# EasyEDA schematic Schematic.json
TITLE: Catch the Light; REV: 1.0; Date: 2024-08-20; Sheet: 1/1; Drawn By: Denis Majrich; Company: The Automation Warehouse
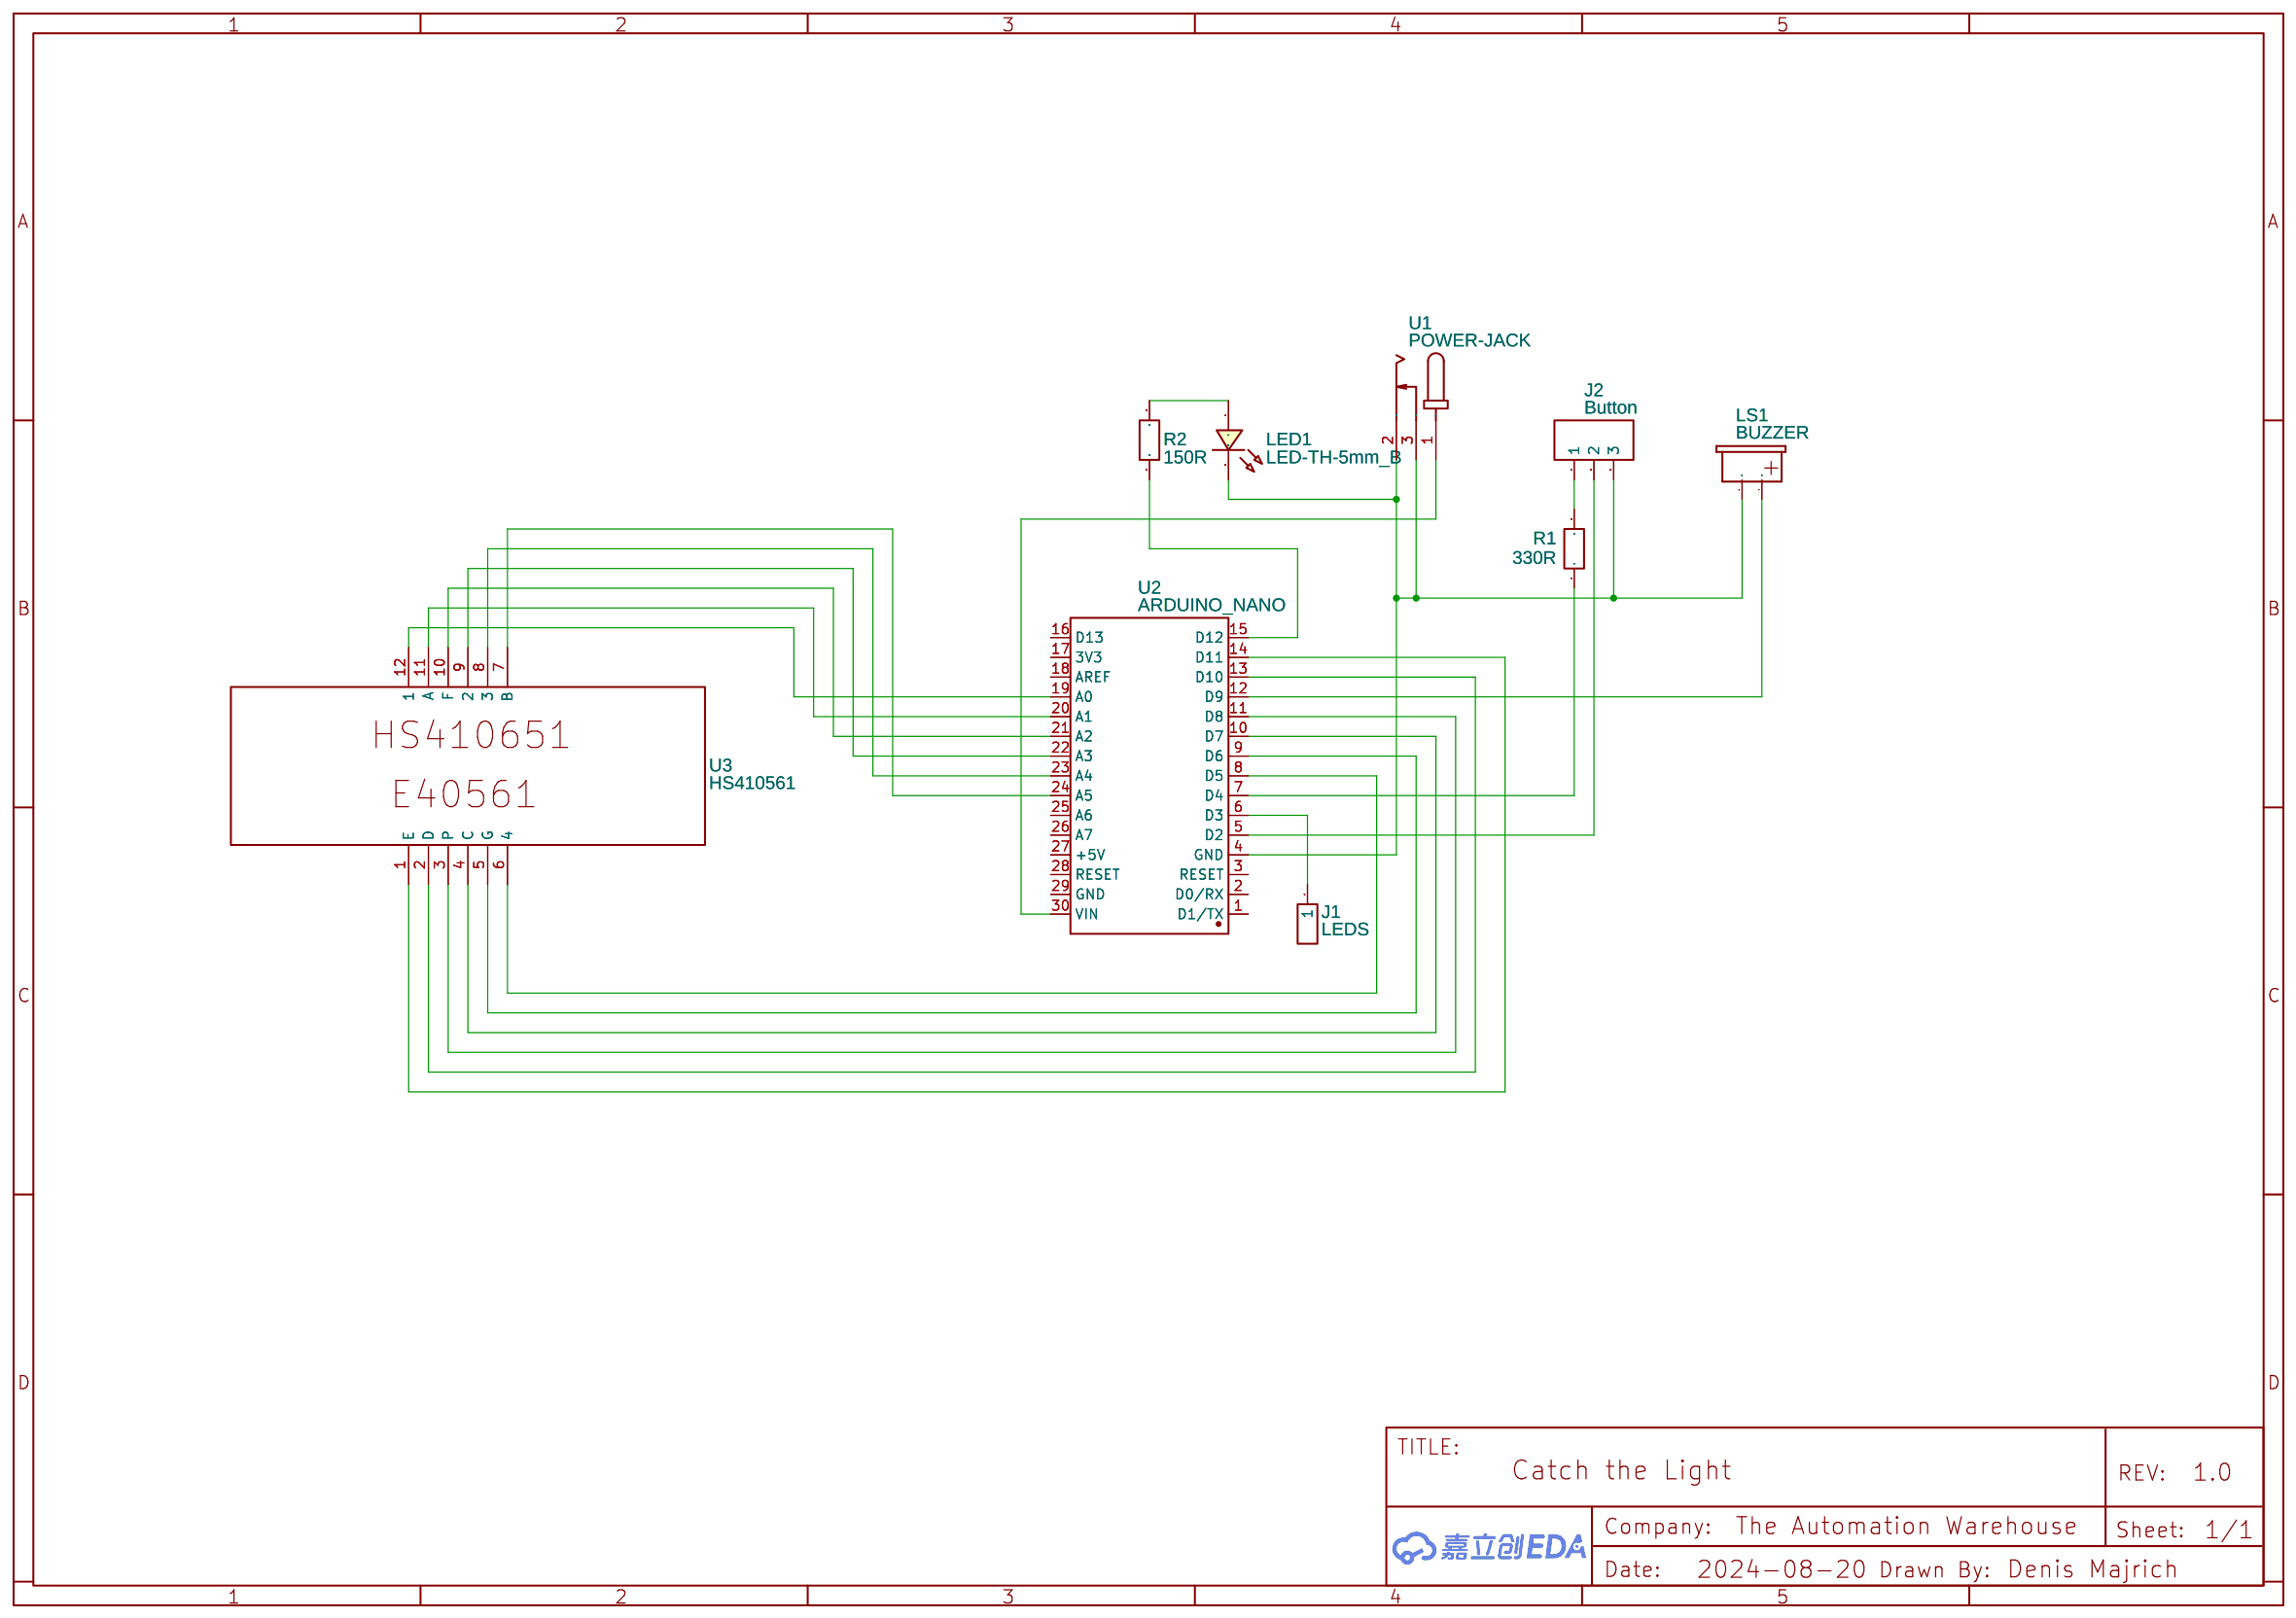
[diagram p0: schematic sheet]

## Parts
J1  LEDS  [HDR-M-2.54_1X1]
J2  Button  [HDR-M-2.54_1X3]
LED1  LED-TH-5mm_B  [LED-TH_BD5.0_BLUE]
LS1  BUZZER  [BUZZER-12MM-KIT]
R1  330R  [R_AXIAL-0.4]
R2  150R  [R_AXIAL-0.4]
U1  POWER-JACK  [DC-IN-TH_POWER-JACK]
U2  ARDUINO_NANO  [COMM-TH_ARDUINO_NANO]
U3  HS410561  [HS410561]

## Library data of the parts
J1 = HDR-M-2.54_1x1: Supplier Part: C81276; Supplier: LCSC; Contributor: LCEDA_Lib
J2 = HDR-M-2.54_1x3: Supplier Part: C180248; Supplier: LCSC; Contributor: LCEDA_Lib
LED1 = LED-TH-5mm_B: Supplier: LCSC; Contributor: LCEDA_Lib
LS1 = BUZZER-passive: Contributor: OlegPCBa
R1 R2 = R_AXIAL-0.4_EU: Contributor: LCEDA_Lib
U1 = POWER-JACK: Supplier: LCSC; Supplier Part: C9900001795; Manufacturer: null; JLCPCB Part Class: Extended Part; Contributor: LCSC
U2 = ARDUINO_NANO: Contributor: lcsc; Supplier: LCSC; Supplier Part: C9900017879; Manufacturer: null; JLCPCB Part Class: Extended Part
U3 = HS410561: Manufacturer: WEIDILY; Supplier Part: ALI; link: https://www.farnell.com/datasheets/2095876.pdf; Contributor: Guest

## Nets
Net-(J1-1): J1.1 U2.6(D3)
Net-(J2-1): J2.1 R1.2
Net-(J2-2): J2.2 U2.5(D2)
Net-(J2-3): J2.3 LED1.2 LS1.+(1) U1.2 U1.3 U2.4(GND)
Net-(LED1-1): LED1.1 R2.2
Net-(LS1--): LS1.-(2) U2.12(D9)
Net-(R1-1): R1.1 U2.7(D4)
Net-(R2-1): R2.1 U2.15(D12)
Net-(U1-1): U1.1 U2.30(VIN)
Net-(U2-8): U2.8(D5) U3.6(4)
Net-(U2-9): U2.9(D6) U3.5(G)
Net-(U2-10): U2.10(D7) U3.4(C)
Net-(U2-11): U2.11(D8) U3.3(P)
Net-(U2-13): U2.13(D10) U3.2(D)
Net-(U2-14): U2.14(D11) U3.1(E)
Net-(U2-19): U2.19(A0) U3.12(1)
Net-(U2-20): U2.20(A1) U3.11(A)
Net-(U2-21): U2.21(A2) U3.10(F)
Net-(U2-22): U2.22(A3) U3.9(2)
Net-(U2-23): U2.23(A4) U3.8(3)
Net-(U2-24): U2.24(A5) U3.7(B)

Not connected (* = marked no-connect by the designer): U2 1(D1/TX) 2(D0/RX) 3(RESET) 16(D13) 17(3V3) 18(AREF) 25(A6) 26(A7) 27(+5V) 28(RESET) 29(GND)
